# EAGLE design pong (EAGLE 9.3.2)
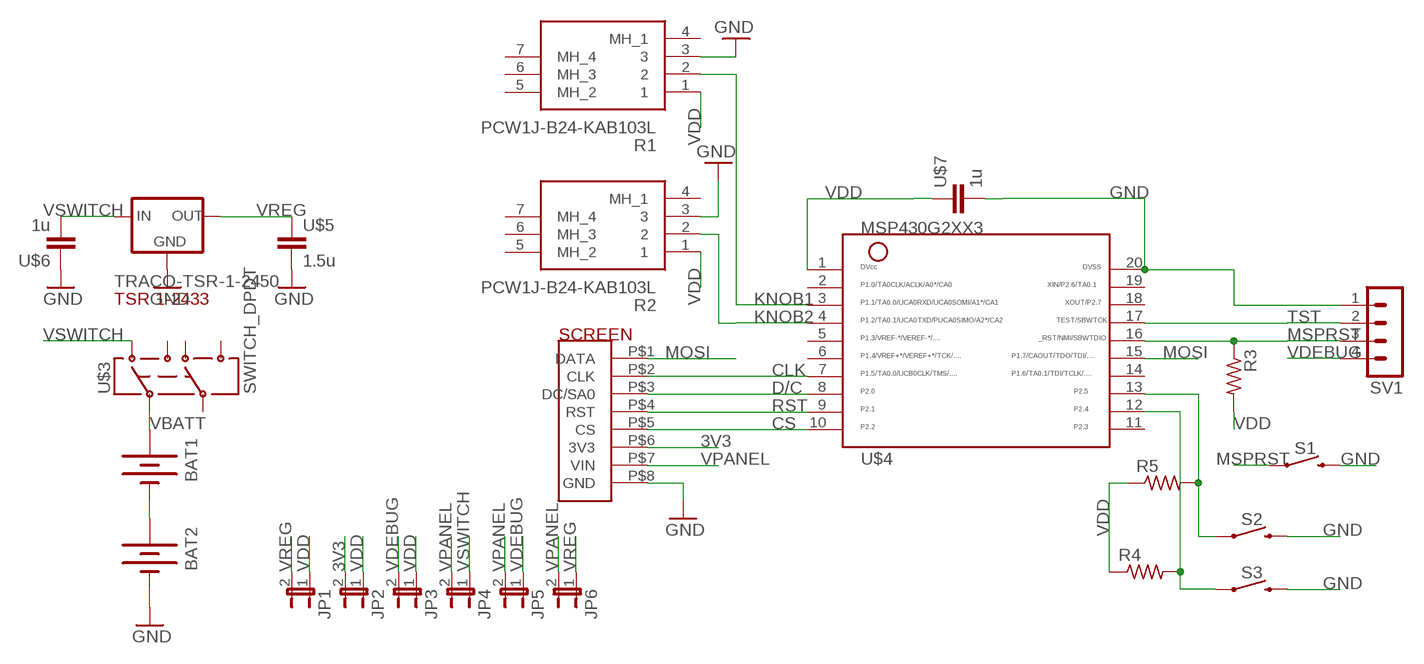
[diagram p0: schematic, sheet 1]

## Parts
BAT1  BATTERY  [BATTERY_PACK_2AA]
BAT2  BATTERY  [BATTERY_PACK_2AA]
JP1  JP1E  [JP1]
JP2  JP1E  [JP1]
JP3  JP1E  [JP1]
JP4  JP1E  [JP1]
JP5  JP1E  [JP1]
JP6  JP1E  [JP1]
R1  PCW1J-B24-KAB103L  [PCW1JB24KAB103L]
R2  PCW1J-B24-KAB103L  [PCW1JB24KAB103L]
R3  47k  R-US_R0805  [R0805]
R4  47k  R-US_R0805  [R0805]
R5  47k  R-US_R0805  [R0805]
S1  MOMENTARY-SWITCH-SPST-PTH-6.0MM  [TACTILE_SWITCH_PTH_6.0MM]
S2  MOMENTARY-SWITCH-SPST-PTH-6.0MM  [TACTILE_SWITCH_PTH_6.0MM]
S3  MOMENTARY-SWITCH-SPST-PTH-6.0MM  [TACTILE_SWITCH_PTH_6.0MM]
SV1  4PINHEAD  [MA04-1]
U$2  SCREEN_HEADER  [SCREEN_FP]
U$3  SWITCH_DPDT  [JS_DPDT_TH]
U$4  MSP430G2XX3TSSOP  [PW20]
U$5  1.5u  CAPACITOR_0805_N  [RESC0805_N]
U$6  1u  CAPACITOR_0805_N  [RESC0805_N]
U$7  1u  CAPACITOR_0805_N  [RESC0805_N]
U$8  TRACO-TSR-1-2450  [SIP3]

## Nets
3V3: JP2.2 U$2.P$6(3V3)
CLK: U$2.P$2(CLK) U$4.7
CS: U$2.P$5(CS) U$4.10
D/C: U$2.P$3(DC/SA0) U$4.8
GND: BAT2.GND(-) R1.3 R2.3 S1.3 S2.3 S3.3 SV1.1 U$2.P$8(GND) U$4.20 U$5.2 U$6.1 U$7.2 U$8.2(GND)
KNOB1: R1.2 U$4.3
KNOB2: R2.2 U$4.4
MOSI: U$2.P$1(DATA) U$4.15
MSPRST: R3.1 S1.1 SV1.3 U$4.16
N$1: R5.2 S2.1 U$4.13
N$2: R4.2 S3.1 U$4.12
N$6: BAT1.GND(-) BAT2.3V(+)
RST: U$2.P$4(RST) U$4.9
TST: SV1.2 U$4.17
VBATT: BAT1.3V(+) U$3.2
VDD: JP1.1 JP2.1 JP3.1 R1.1 R2.1 R3.2 R4.1 R5.1 U$4.1 U$7.1
VDEBUG: JP3.2 JP5.1 SV1.4
VPANEL: JP4.2 JP5.2 JP6.2 U$2.P$7(VIN)
VREG: JP1.2 JP6.1 U$5.1 U$8.3(OUT)
VSWITCH: JP4.1 U$3.1 U$6.2 U$8.1(IN)
Unconnected: R1.4(MH_1) R1.5(MH_2) R1.6(MH_3) R1.7(MH_4) R2.4(MH_1) R2.5(MH_2) R2.6(MH_3) R2.7(MH_4) U$3.3 U$3.4 U$3.5 U$3.6 U$4.2 U$4.5 U$4.6 U$4.11 U$4.14 U$4.18 U$4.19

## Notes on the sheet
- TSR 1-2433
- SCREEN

## Library data of the parts
BAT1 BAT2 = ELEC327:BATTERY: Battery Holders Various common sizes : AA, AAA, 20mm coin cell and 12mm coin cell. 20MM_4LEGS, BATT-10373
JP1-JP6 = jumper:JP1E: JUMPER
R1 R2 = ELEC327:PCW1J-B24-KAB103L: 22mm Sq Slimline Panel Control,1Turn,10K Bourns PC Series, Linear Conductive Plastic Potentiometer with a 6.35 mm Dia. Shaft, 10k, +/-20%, 0.75W, +/-1000ppm/C Source: Datasheet <http://www.bourns.com/docs/Product-Datasheets/slimline.pdf>; ALLIED_NUMBER: 70408312; ALLIED_PRICE-STOCK: https://www.alliedelec.com/bourns-pcw1j-b24-kab103l/70408312/; DESCRIPTION: 22mm Sq Slimline Panel Control,1Turn,10K Bourns PC Series, Linear Conductive Plastic Potentiometer with a 6.35 mm Dia. Shaft, 10k, +/-20%, 0.75W, +/-1000ppm/C; HEIGHT: 32mm; MANUFACTURER_NAME: Bourns; MANUFACTURER_PART_NUMBER: PCW1J-B24-KAB103L; MOUSER_PART_NUMBER: 652-PCW1JB24KAB103L; MOUSER_PRICE-STOCK: https://www.mouser.com/Search/Refine.aspx?Keyword=652-PCW1JB24KAB103L; RS_PART_NUMBER: 1674561; RS_PRICE-STOCK: http://uk.rs-online.com/web/p/products/1674561
R3-R5 = audio amplifier example:R-US_: RESISTOR, American symbol
S1-S3 = SparkFun-Switches:MOMENTARY-SWITCH-SPST: Momentary Switch (Pushbutton) - SPST Normally-open (NO) SPST momentary switches (buttons, pushbuttons). Variants PTH-12MM - 12mm square, through-hole Momentary Pushbutton Switch - 12mm Square <https://www.sparkfun.com/products/9190> (COM-09190) PTH-6.0MM, PTH-6.0MM-KIT - 6.0mm square, through-hole Mini Pushbutton Switch <https://www.sparkfun.com/products/97> (COM-00097) KIT package intended for soldering kit's - only one side of pads' copper is exposed. PTH-RIGHT-ANGLE-KIT - Right-angle, through-hole Right Angle Tactile Button <https://www.sparkfun.com/products/10791> - Used on SparkFun BigTime Watch Kit <https://www.sparkfun.com/products/11734> SMD-12MM - 12mm square, surface-mount Tactile Button - SMD (12mm) <https://www.sparkfun.com/products/12993> (COM-12993) Used on SparkFun PicoBoard <https://www.sparkfun.com/products/11888> SMD-4.5MM - 4.5mm Square Trackball Switch Used on SparkFun Blackberry Trackballer Breakout <https://www.sparkfun.com/products/13169> SMD-4.6MMX2.8MM - 4.60mm x 2.80mm, surface mount Used on SparkFun SAMD21 Mini Breakout <https://www.sparkfun.com/products/13664> SMD-5.2MM, SMD-5.2-REDUNDANT - 5.2mm square, surface-mount Mini Pushbutton Switch - SMD <https://www.sparkfun.com/products/8720> (COM-08720) Used on Arduino Pro Mini <https://www.sparkfun.com/products/11114> REDUNDANT package connects both switch circuits together SMD-6.0X3.5MM - 6.0 x 3.5mm, surface mount Momentary Reset Switch SMD <https://www.sparkfun.com/products/8229> (COM-08229) SMD-6.2MM-TALL - 6.2mm square, surface mount Tactile Button - SMD (6mm) <https://www.sparkfun.com/products/12992> Used on SparkFun Digital Sandbox <https://www.sparkfun.com/products/12651> SMD-RIGHT-ANGLE - Right-angle, surface mount Used on SparkFun Block for Intel® Edison - Arduino <https://www.sparkfun.com/products/13036>; PROD_ID: SWCH-08441; SF_SKU: COM-00097
SV1 = master_library:4PINHEAD: PIN HEADER; OC_FARNELL: unknown; OC_NEWARK: unknown
U$2 = ELEC327:SCREEN_HEADER
U$3 = ELEC327:SWITCH_DPDT
U$4 = ELEC327:MSP430G2XX3: MSP430G2XX3 PDIP (N) 20 Pin Package
U$5-U$7 = Nordic_nRF:CAPACITOR: Generic chip capacitor
U$8 = master_library:TRACO-TSR-1-2450: An all-in-one switching regulator from TRACO

## Board
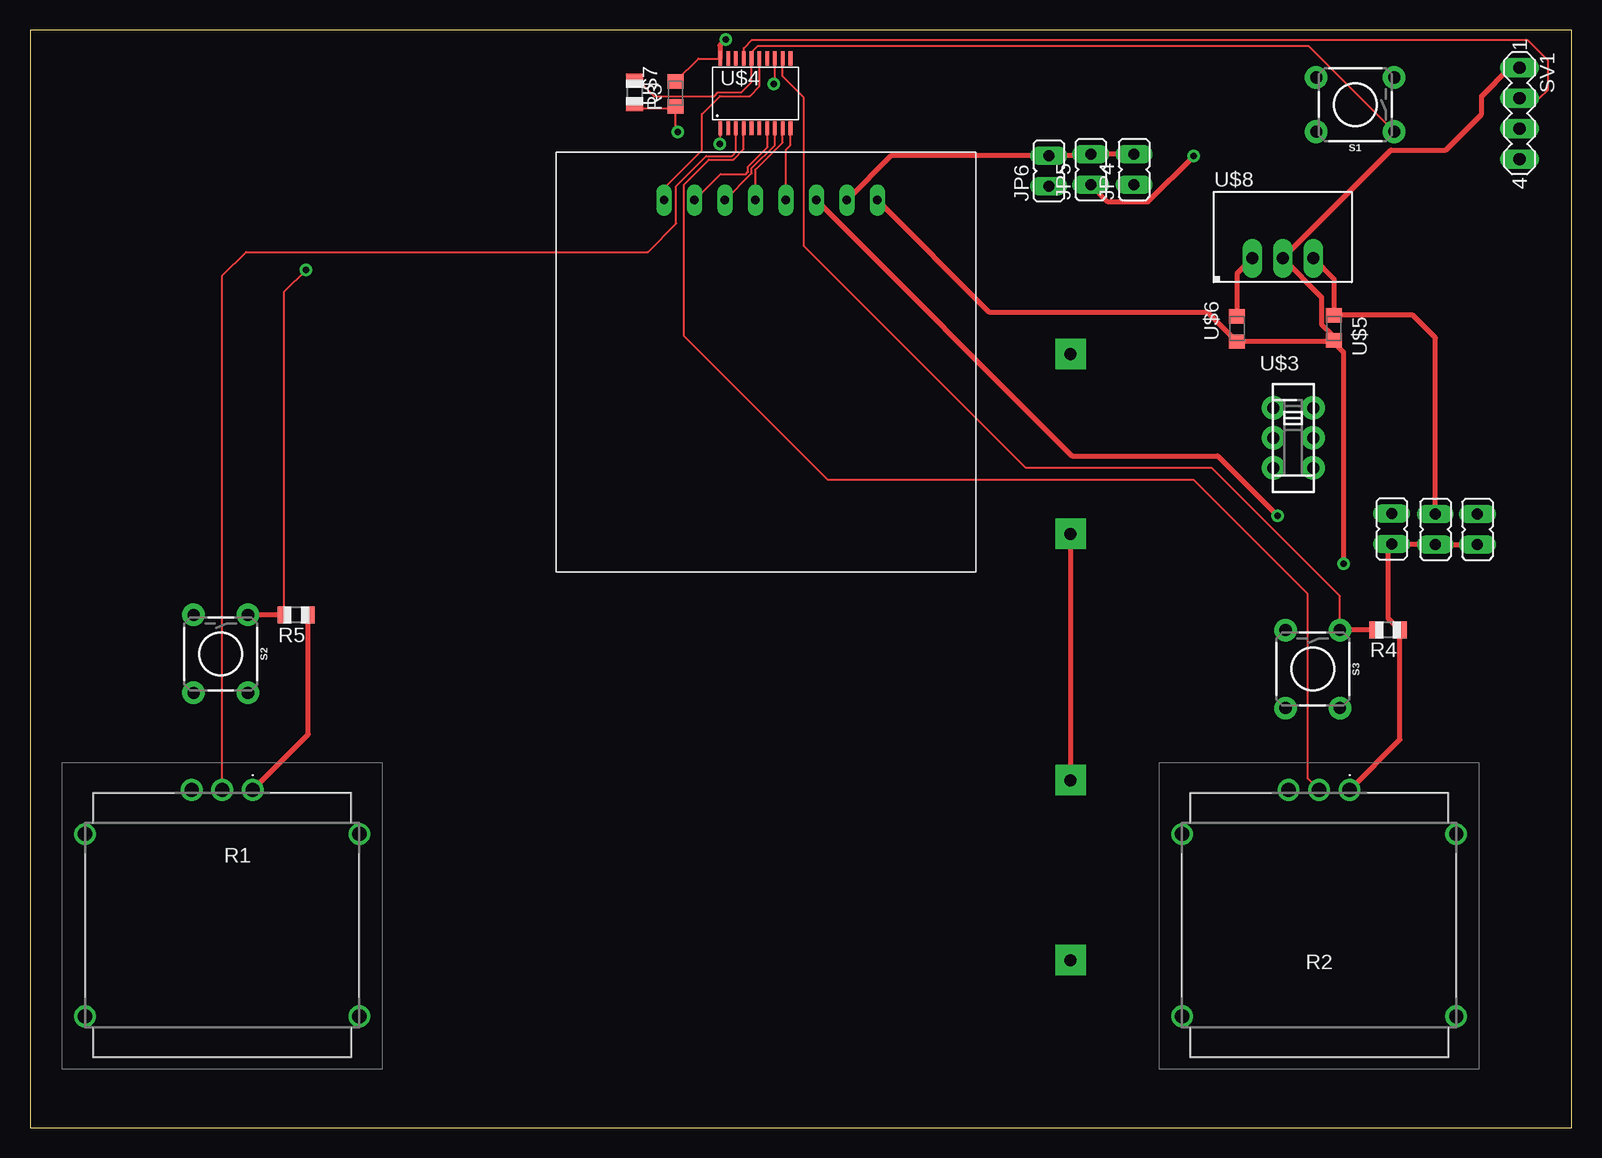
[diagram p1: board, top side]
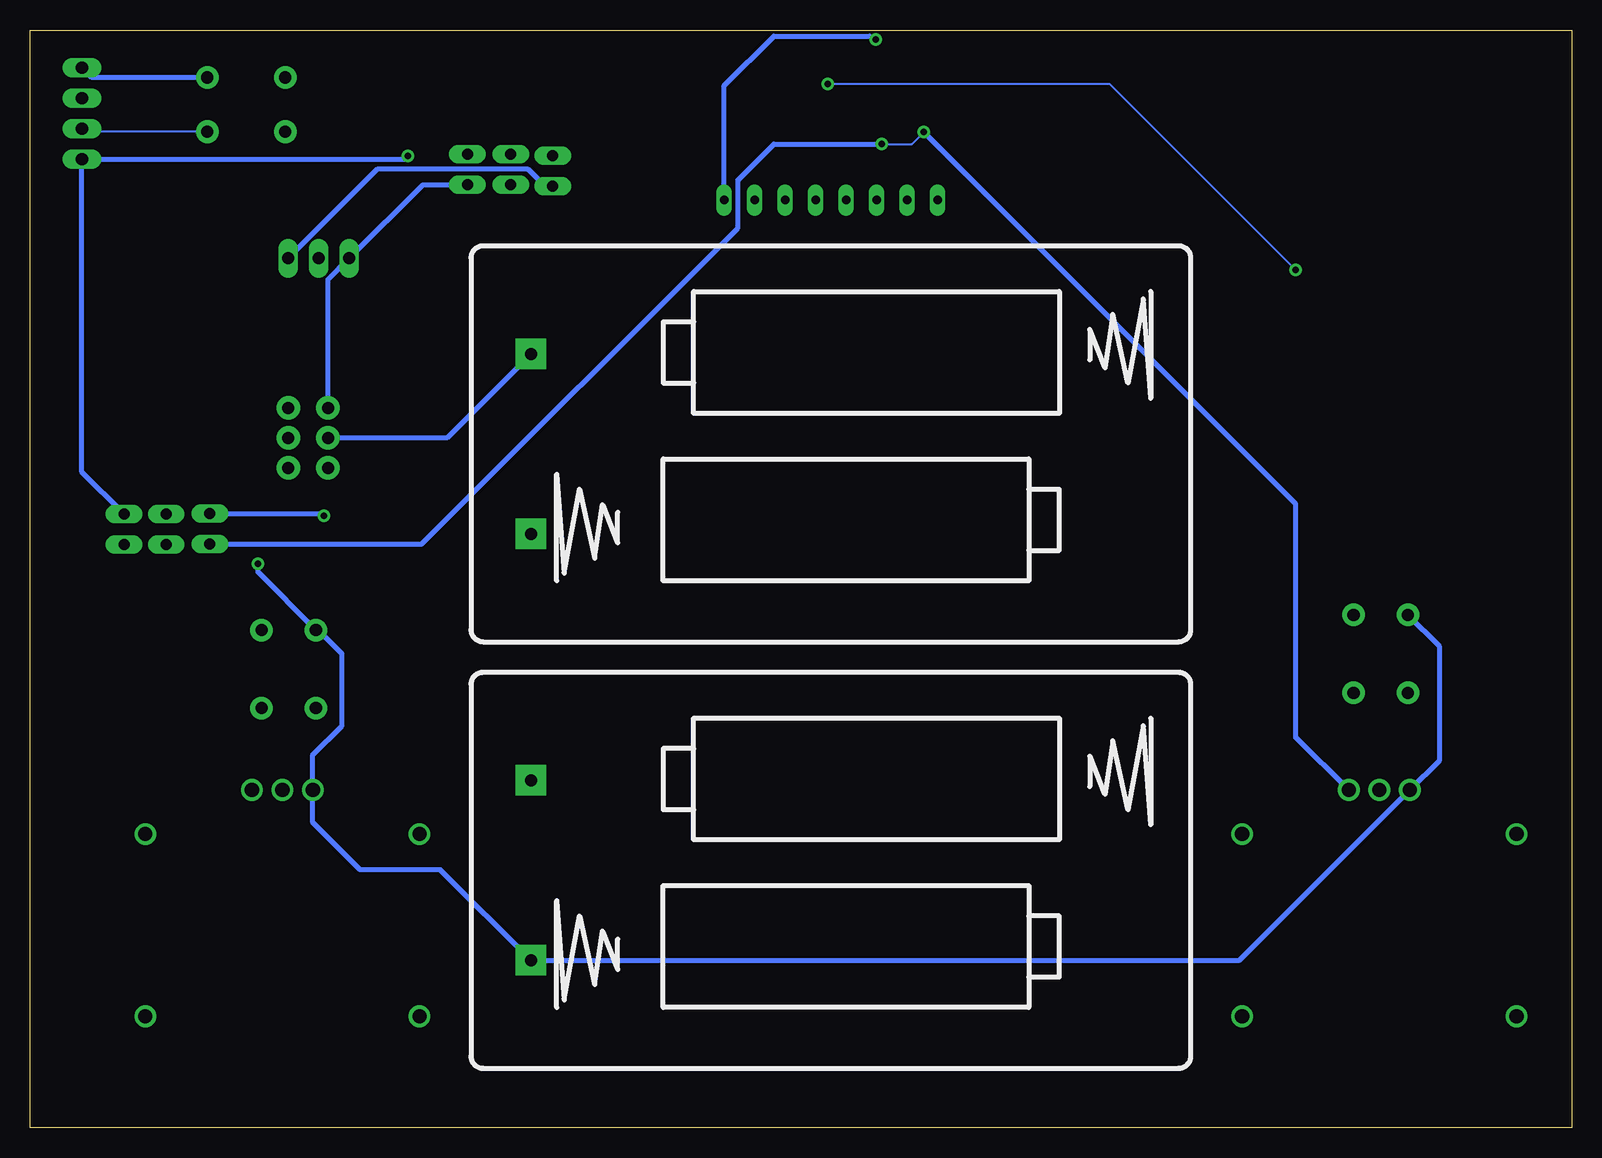
[diagram p2: board, bottom side, seen from below]

Size 128.5 x 91.5 mm. Coordinates in mm from the lower left corner, seen from the top.
Outline: 0,0 128.5,0 128.5,91.5 0,91.5 0,0
Copper layers (1*16): Top 0.035mm / dielectric 1.5mm / Bottom 0.035mm
Design rules "AdvancedCircuitsBarebones": minimum track width 6mil, minimum drill 20mil, track to track 6mil, track to pad 6mil, pad to pad 6mil, via to via 6mil, smd to smd 6mil, copper to edge 10mil, drill to drill 6mil, minimum pad ring 12mil, minimum via ring 10mil, stop-mask expansion 4mil, vias tented up to drill 25mil, thermal gap 10mil

### Footprints (pad centres in the part's own frame; a part is rotated, then mirrored left to right if it is on the bottom)
BATTERY_PACK_2AA = drill 1 pad 2.54 square: 3V 7.5,25; GND -7.5,25
JP1 = drill 0.914 long: 1 0,-1.27; 2 0,1.27
PCW1JB24KAB103L = drill 1.19 pad 1.785: 1 -2.54,-10.512; 2 0,-10.512; 3 2.54,-10.512; 4 -11.43,-6.842; 5 11.43,-6.842; 6 -11.43,8.358; 7 11.43,8.358
R0805 = smd 1.1 x 1.4: 1 -1,0; 2 1,0
TACTILE_SWITCH_PTH_6.0MM = drill 1.016 pad 1.88: 1 -3.251,2.261; 2 3.251,2.261; 3 -3.251,-2.261; 4 3.251,-2.261
MA04-1 = drill 1.016 long: 1 -3.81,0; 2 -1.27,0; 3 1.27,0; 4 3.81,0
SCREEN_FP = drill 0.7 long: P$1 0,0; P$2 2.54,0; P$3 5.08,0; P$4 7.62,0; P$5 10.16,0; P$6 12.7,0; P$7 15.24,0; P$8 17.78,0
JS_DPDT_TH = drill 1 pad 1.93: 1 -2.5,-1.65; 2 0,-1.65; 3 2.5,-1.65; 4 -2.5,1.65; 5 0,1.65; 6 2.5,1.65
PW20 = smd 0.3 x 1.2: 1 -2.925,-2.9; 2 -2.275,-2.9; 3 -1.625,-2.9; 4 -0.975,-2.9; 5 -0.325,-2.9; 6 0.325,-2.9; 7 0.975,-2.9; 8 1.625,-2.9; 9 2.275,-2.9; 10 2.925,-2.9; 11 2.925,2.9; 12 2.275,2.9; 13 1.625,2.9; 14 0.975,2.9; 15 0.325,2.9; 16 -0.325,2.9; 17 -0.975,2.9; 18 -1.625,2.9; 19 -2.275,2.9; 20 -2.925,2.9
RESC0805_N = smd 1.2 x 1.35: 1 -1.1,0; 2 1,0
SIP3 = drill 1 long: 1 -2.54,0; 2 0,0; 3 2.54,0

### Placement (x,y rotation side)
BAT1  61.74,57 90 bottom
BAT2  61.74,21.44 90 bottom
JP1  117.15,49.87 0 top
JP2  113.51,49.91 0 top
JP3  120.66,49.87 0 top
JP4  92.04,79.87 0 top
JP5  88.42,79.87 0 top
JP6  84.92,79.75 0 top
R1  16.02,17.63 180 top
R2  107.46,17.63 180 top
R3  50.4,86.29 270 top
R4  113.2,41.49 180 top
R5  22.19,42.72 180 top
S1  110.47,85.28 180 top
S2  15.9,39.49 270 top
S3  106.93,38.22 270 top
SV1  124.17,84.55 270 top
U$2  52.85,77.32 0 top
U$3  105.31,57.5 270 top
U$4  60.47,86.21 0 top
U$5  108.69,66.62 270 top
U$6  100.61,66.62 90 top
U$7  53.81,86.21 90 top
U$8  104.42,72.47 0 top

### Tracks (layer width: path | path; a pad name or v marks a point on that pad's centre or on a via)
3V3  (via drill 0.55)
  Top 0.406: U$2.P$6 86.87,56 99,56 v104,51
  Bottom 0.406: JP2.2 104.18,51.18 v104,51
CLK
  Top 0.152: U$2.P$2 57.57,79.5 59.68,79.5 59.86,79.68 59.86,80.11 61.49,81.74 61.49,83.27 U$4.7
CS
  Top 0.152: U$2.P$5 63.01,81.51 63.4,81.9 U$4.10
D/C
  Top 0.152: U$2.P$3 60.16,79.56 60.16,79.99 62.09,81.92 U$4.8
GND  (via drill 0.55)
  Top 0.152: U$7.2 55.71,89.11 57.5,89.11 U$4.20
  Top 0.406: U$5.2 108.59,65.52 | 108.59,65.52 U$6.1 98.13,68 79.95,68 U$2.P$8 | v58,90.72 57.5,90.22 57.5,89.11 | 108.59,65.52 108.59,66.04 107.66,66.97 107.66,69.23 U$8.2 113.45,81.5 118,81.5 121,84.5 121,86 123.36,88.36 SV1.1 | v109.5,47 109.5,64.61 108.59,65.52
  Bottom 0.406: S2.3 11,40.1 11,30.62 R1.3 27.68,13.94 BAT2.GND 94.3,21.5 101,21.5 104.92,25.42 R2.3 104.92,31.08 102.5,33.5 102.5,39.5 104.47,41.47 S3.3 109.5,46.3 v109.5,47 | S1.3 123.35,87.54 SV1.1 | U$2.P$8 70.63,86.87 66.5,91 58.5,91 58.22,90.72 v58,90.72
KNOB1
  Top 0.152: R1.2 16.02,71.02 18,73 51.5,73 53.86,75.36 53.86,78.49 56.37,81 58.5,81 58.84,81.34 U$4.3
KNOB2
  Top 0.152: R2.2 106.5,29.1 106.5,44.5 97,54 92,54 66.5,54 54.5,66 54.5,78.59 56.6,80.69 58.63,80.69 59.49,81.56 U$4.4
MOSI
  Top 0.152: U$2.P$1 52.85,78.32 56,81.47 56,84.5 57.5,86 60,86 60.8,86.8 U$4.15
MSPRST
  Top 0.152: R3.1 50.71,87.29 52,86 57.07,86 57.37,86.31 59.3,86.31 60.15,87.14 U$4.16 60.15,89.64 60.68,90.18 106.56,90.18 S1.1
  Bottom 0.152: S1.1 123.91,83.02 SV1.3
N$1  (via drill 0.55)
  Top 0.152: R5.2 21.19,69.69 v23,71.5 | v62,87 62.09,87.09 U$4.13
  Top 0.406: R5.2 18.18,42.72 S2.1
  Bottom 0.152: v23,71.5 38.5,87 v62,87
N$2
  Top 0.152: S3.1 109.19,44.31 98.5,55 83,55 64.5,73.5 64.5,85.87 62.74,87.63 U$4.12
  Top 0.406: R4.2 112.18,41.47 S3.1
N$6
  Top 0.406: BAT1.GND BAT2.3V
RST
  Top 0.152: U$2.P$4 60.47,79.86 62.76,82.15 62.74,82.16 U$4.9
TST
  Top 0.152: U$4.17 | U$4.17 59.5,90 60.18,90.68 124.82,90.68 126.5,89 126.5,86.5 125.82,85.82 SV1.2
VBATT
  Bottom 0.406: BAT1.3V 93.74,57.5 U$3.2
VDD  (via drill 0.55)
  Top 0.152: U$4.1 57.5,83.27 v57.5,82 | v54,83 53.81,83.19 53.81,85 | 53.81,85 U$7.1 | R3.2 50.69,85 53.81,85
  Top 0.406: R1.1 23.19,32.77 R5.1 | R2.1 114.2,32.34 R4.1 113.2,42.49 113.2,48.33 JP2.1 117.12,48.64 JP1.1 JP3.1
  Bottom 0.152: v57.5,82 55,82 v54,83
  Bottom 0.406: JP2.1 95.86,48.64 69.5,75 69.5,79 66.5,82 v57.5,82 | R1.1 22.92,32.5 23,32.5 23,52 v54,83
VDEBUG  (via drill 0.55)
  Top 0.406: JP5.1 89.87,77.15 93.15,77.15 v97,81
  Bottom 0.406: JP3.2 124.17,54.65 SV1.4 97.26,80.74 v97,81
VPANEL
  Top 0.406: JP4.2 JP5.2 88.3,81.02 JP6.2 71.79,81.02 U$2.P$7
VREG
  Top 0.406: U$8.3 108.69,70.74 U$5.1 115.28,67.72 117.15,65.85 JP1.2
  Bottom 0.406: JP6.1 85.58,78.48 87.02,79.92 99.51,79.92 U$8.3
VSWITCH
  Top 0.406: U$8.1 100.61,71.2 U$6.2
  Bottom 0.406: U$3.1 103.66,70.69 U$8.1 95.75,78.6 JP4.1